# Altium schematic sheet ADC.SchDoc
size A4
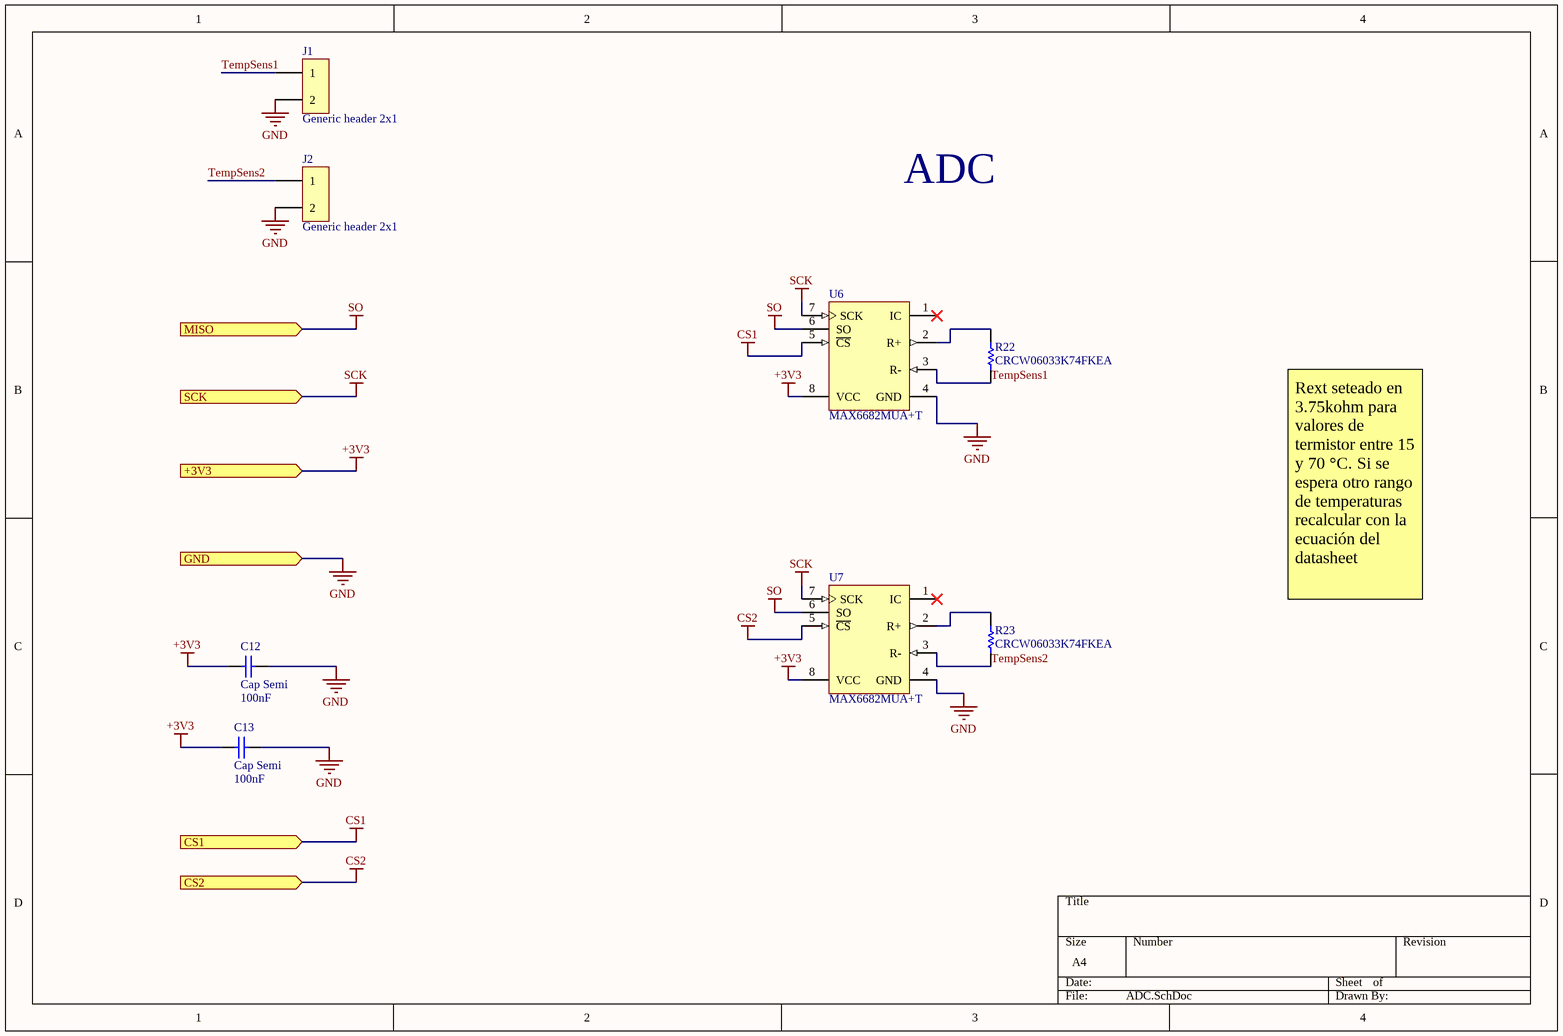
[diagram p0: ADC.SchDoc]

## Parts
C12  Cap Semi  value 100nF  [1608[0603]]
C13  Cap Semi  value 100nF  [1608[0603]]
J1  Generic header 2x1  [JST-2x1]
J2  Generic header 2x1  [JST-2x1]
R22  CRCW06033K74FKEA  [RESC1609X50X30LL10T20]
R23  CRCW06033K74FKEA  [RESC1609X50X30LL10T20]
U6  MAX6682MUA+T  [MAXM-U8+1_L]
U7  MAX6682MUA+T  [MAXM-U8+1_L]

## Ports
+3V3 (in), CS1 (in), CS2 (in), GND (in), MISO (in), SCK (in)

## Nets
+3V3: C12.2 C13.2 U6.8(VCC) U7.8(VCC) ; port +3V3
CS1: U6.5(~{CS}) ; port CS1
CS2: U7.5(~{CS}) ; port CS2
GND: C12.1 C13.1 J1.2 J2.2 U6.4(GND) U7.4(GND) ; port GND
SCK: U6.7(SCK) U7.7(SCK) ; port SCK
SO: U6.6(SO) U7.6(SO) ; port MISO
TempSens1: J1.1 R22.1 U6.3(R-)
TempSens2: J2.1 R23.1 U7.3(R-)
NetR22_2: R22.2 U6.2(R+)
NetR23_2: R23.2 U7.2(R+)

Not connected (* = marked no-connect by the designer): U6 1(IC)*; U7 1(IC)*

## Notes on the sheet
- ADC
- Rext seteado en 3.75kohm para valores de termistor entre 15 y 70 °C. Si se espera otro rango de temperaturas recalcular con la ecuación del datasheet

## Library data of the parts
C12 C13 = Cap Semi: Capacitor (Semiconductor SIM Model); Manufacturer: Taiyo Yuden; Manufacturer Part Number: UMK107B104KAHT; Published: 8-Jun-2000; LatestRevisionDate: 29-May-2009; LatestRevisionNote: IPC-7351 Footprint Added.; PackageReference: C0603; Publisher: Altium Limited; PackageDescription: Chip Capacitor; Supplier 1: LCSC; Supplier Part Number 1: C386152
J1 J2 = Header - 2x1: Generic Header 2pos, 1 row, 2.54 pitch; Manufacturer: CJT(Changjiang Connectors); Manufacturer Part Number: A2547WV-2P; Pitch: 2.54mm; Supplier 1: LCSC; Supplier Part Number 1: C239377; Package: Through Hole,P=2.54mm
R22 R23 = CMP-2000-03309-1: Manufacturer: Vishay Dale; Part Number: CRCW06033K74FKEA
U6 U7 = CMP-0253-01037-1: Thermistor-to-Digital Converter, 10 Bits Temperature Resolution, -55 to 125 degC, 8-Pin SOP (U8+1), Pb-Free, Tape and Reel; Interface: 3-Wire/SPI; Parasite Pwr.: No; Functions: Thermistor-to-Digital Converter; DatasheetVersion: Rev. 0; ComponentLink2Description: Datasheet; PackageReference: U8+1; PartNumber: MAX6682MUA+T; PackageDescription: 8-Pin Micro-MAX, Thin Shrink Small-Outline (U8+1), Body 3 x 3 mm, Pitch 0.65 mm; Packing: Tape and Reel; ComponentLink1Description: Manufacturer URL; ComponentLink3URL: http://pdfserv.maximintegrated.com/package_dwgs/21-0036.PDF; ComponentLink2URL: http://datasheets.maximintegrated.com/en/ds/MAX6682.pdf; ComponentLink3Description: Package Specification; Generic Part Number: MAX6682; PackageVersion: Rev. L, 08/2009; ComponentLink1URL: http://www.maximintegrated.com/; Code_JEDEC: MO-187; Mounting Technology: Surface Mount